# EAGLE board telakone (EAGLE 7.6.0)
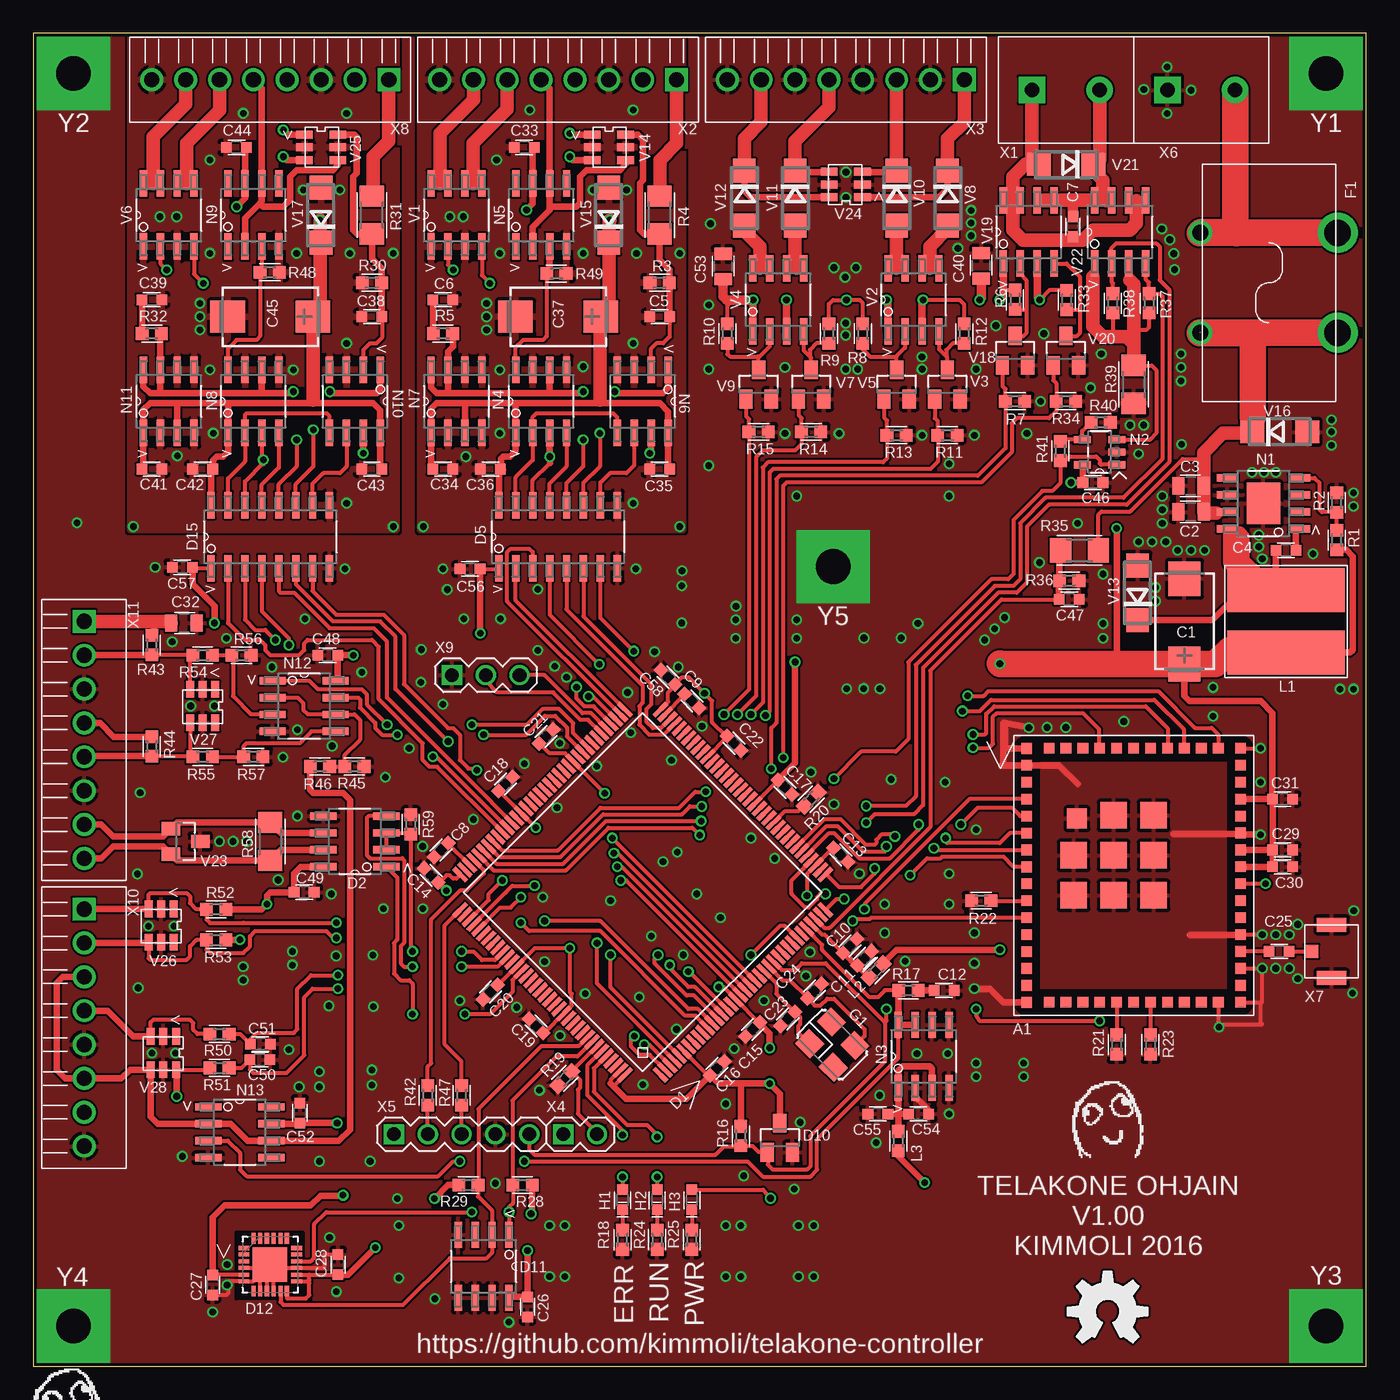
[diagram p8: board, top side]
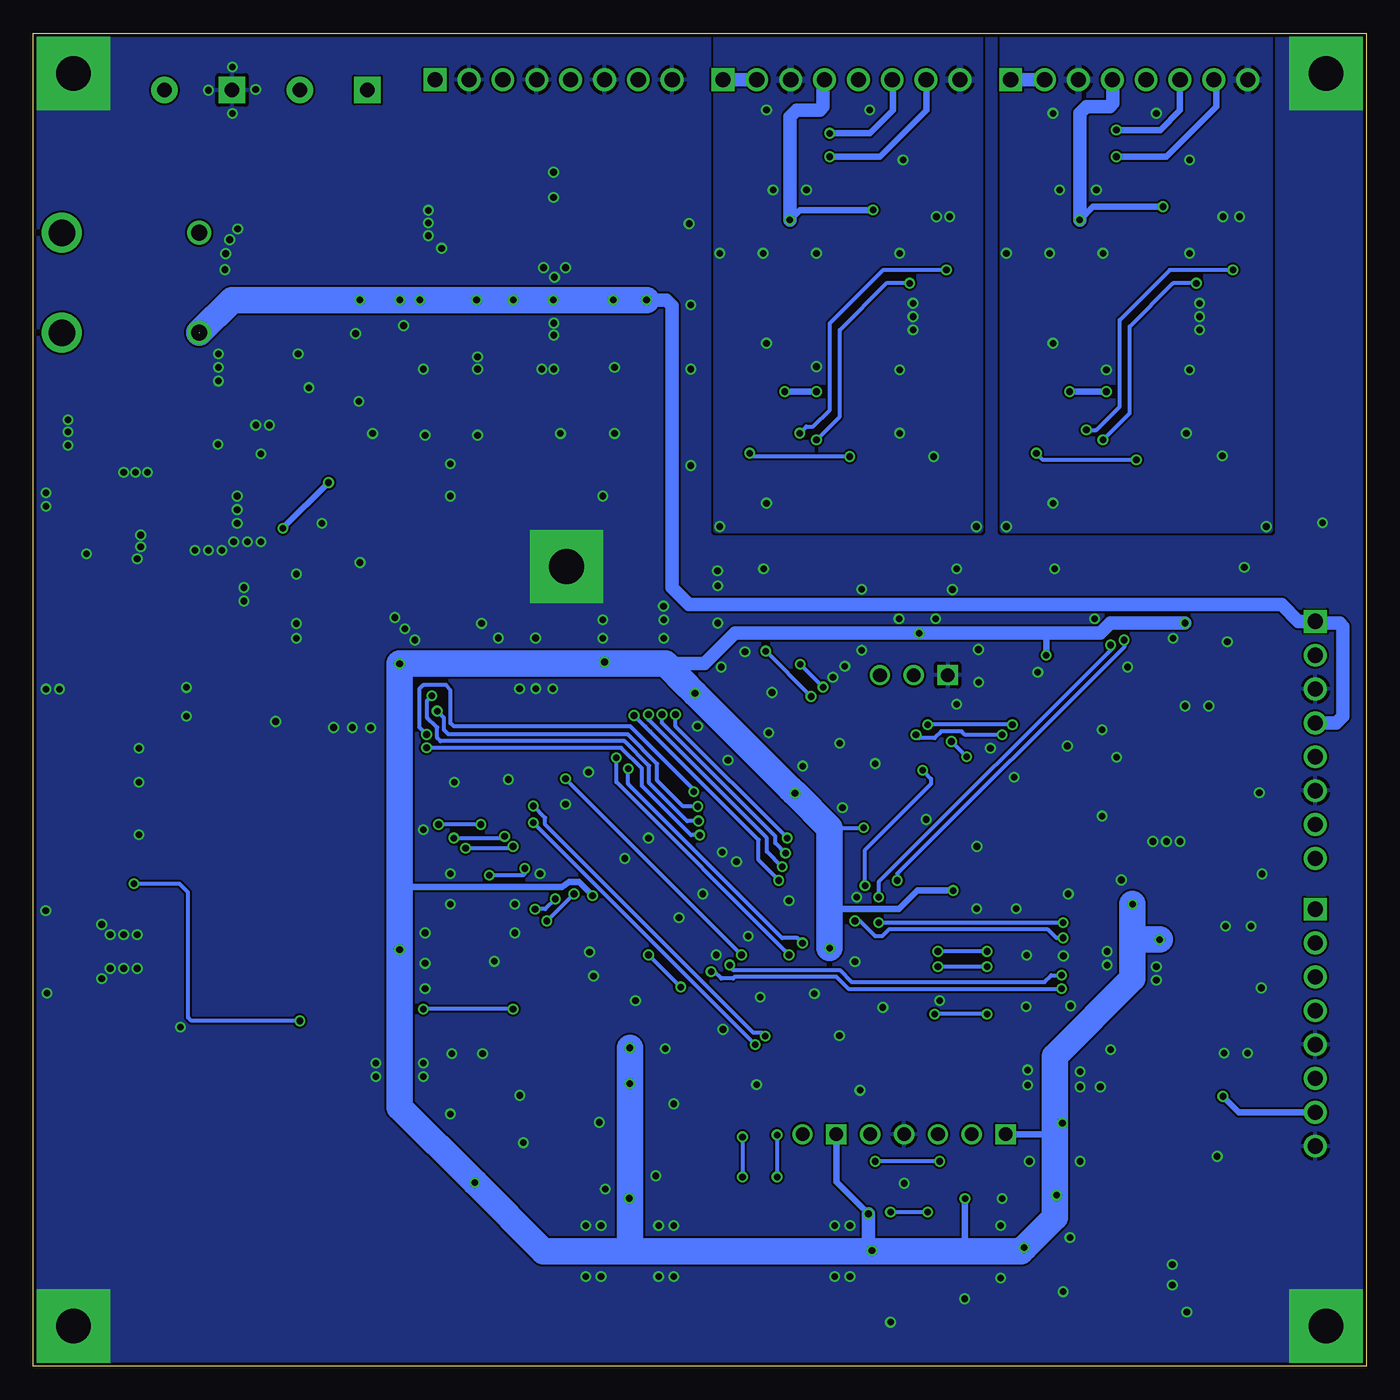
[diagram p9: board, bottom side, seen from below]

Size 100 x 100 mm. Coordinates in mm from the lower left corner, seen from the top.
Outline: 0,0 100,0 100,100 0,100 0,0
Copper layers (1*16): Top 0.035mm / dielectric 1.5mm / Bottom 0.035mm
Design rules "ITEADstudio_DRC": minimum track width 6mil, minimum drill 12mil, track to track 6mil, track to pad 6mil, pad to pad 6mil, via to via 6mil, smd to smd 0mil, copper to edge 10mil, drill to drill 10mil, minimum pad ring 10mil, minimum via ring 6mil, stop-mask expansion 2mil, vias tented up to drill 100mil, thermal gap 10mil
Net classes: 1 isolation: width 0.3 mm, drill 0.5 mm; 2 other: width 0.3 mm, drill 0.3 mm, clearance 1 mm to class 1
tRestrict: area 15.2,5.1 to 20.2,10; area 57.3,21.5 to 62.6,26.8; 4 lines

## Footprints (pad centres in the part's own frame; a part is rotated, then mirrored left to right if it is on the bottom)
CC3100MOD = smd 0.8 x 0.8: P1 9.52,8.025; P2 8.25,8.025; P3 6.98,8.025; P4 5.71,8.025; P5 4.44,8.025; P6 3.17,8.025; P7 1.9,8.025; P8 0.63,8.025; P9 -0.64,8.025; P10 -1.91,8.025; P11 -3.18,8.025; P12 -4.45,8.025; P13 -5.72,8.025; P14 -6.99,8.025; P15 -8.26,8.025; P16 -9.53,8.025; P17 -9.525,6.35; P18 -9.525,5.08; P19 -9.525,3.81; P20 -9.525,2.54; P21 -9.525,1.27; P22 -9.525,0; P23 -9.525,-1.27; P24 -9.525,-2.54; P25 -9.525,-3.81; P26 -9.525,-5.08; P27 -9.525,-6.35; P28 -9.525,-8.02; P29 -8.255,-8.02; P30 -6.985,-8.02; P31 -5.715,-8.02; P32 -4.445,-8.02; P33 -3.175,-8.02; P34 -1.905,-8.02; P35 -0.635,-8.02; P36 0.635,-8.02; P37 1.905,-8.02; P38 3.175,-8.02; P39 4.445,-8.02; P40 5.715,-8.02; P41 6.985,-8.02; P42 8.255,-8.02; P43 9.525,-8.02; P44 9.525,-6.35; P45 9.525,-5.08; P46 9.525,-3.81; P47 9.525,-2.54; P48 9.525,-1.27; P49 9.525,0; P50 9.525,1.27; P51 9.525,2.54; P52 9.525,3.81; P53 9.525,5.08; P54 9.525,6.35 | smd 1.5 x 1.5: P55 4.25,4.25 | smd 2 x 2: P56 1.5,-1.5; P57 -1.5,4.5; P58 4.5,1.5; P59 1.5,1.5; P60 -1.5,1.5; P61 4.5,-1.5; P62 1.5,4.5; P63 -1.5,-1.5
CT7343 = smd 2.6 x 2.4: + 3.2,0; - -3.2,0
C0805 = smd 0.9 x 1.3: 1 -0.95,0; 2 0.95,0
C0603 = smd 0.8 x 0.8: 1 -0.75,0; 2 0.75,0
LQFP-144 = smd 0.34 x 1.35: 1 -8.75,-10.625; 2 -8.25,-10.625; 3 -7.75,-10.625; 4 -7.25,-10.625; 5 -6.75,-10.625; 6 -6.25,-10.625; 7 -5.75,-10.625; 8 -5.25,-10.625; 9 -4.75,-10.625; 10 -4.25,-10.625; 11 -3.75,-10.625; 12 -3.25,-10.625; 13 -2.75,-10.625; 14 -2.25,-10.625; 15 -1.75,-10.625; 16 -1.25,-10.625; 17 -0.75,-10.625; 18 -0.25,-10.625; 19 0.25,-10.625; 20 0.75,-10.625; 21 1.25,-10.625; 22 1.75,-10.625; 23 2.25,-10.625; 24 2.75,-10.625; 25 3.25,-10.625; 26 3.75,-10.625; 27 4.25,-10.625; 28 4.75,-10.625; 29 5.25,-10.625; 30 5.75,-10.625; 31 6.25,-10.625; 32 6.75,-10.625; 33 7.25,-10.625; 34 7.75,-10.625; 35 8.25,-10.625; 36 8.75,-10.625; 73 8.75,10.625; 74 8.25,10.625; 75 7.75,10.625; 76 7.25,10.625; 77 6.75,10.625; 78 6.25,10.625; 79 5.75,10.625; 80 5.25,10.625; 81 4.75,10.625; 82 4.25,10.625; 83 3.75,10.625; 84 3.25,10.625; 85 2.75,10.625; 86 2.25,10.625; 87 1.75,10.625; 88 1.25,10.625; 89 0.75,10.625; 90 0.25,10.625; 91 -0.25,10.625; 92 -0.75,10.625; 93 -1.25,10.625; 94 -1.75,10.625; 95 -2.25,10.625; 96 -2.75,10.625; 97 -3.25,10.625; 98 -3.75,10.625; 99 -4.25,10.625; 100 -4.75,10.625; 101 -5.25,10.625; 102 -5.75,10.625; 103 -6.25,10.625; 104 -6.75,10.625; 105 -7.25,10.625; 106 -7.75,10.625; 107 -8.25,10.625; 108 -8.75,10.625 | smd 1.35 x 0.34: 37 10.625,-8.75; 38 10.625,-8.25; 39 10.625,-7.75; 40 10.625,-7.25; 41 10.625,-6.75; 42 10.625,-6.25; 43 10.625,-5.75; 44 10.625,-5.25; 45 10.625,-4.75; 46 10.625,-4.25; 47 10.625,-3.75; 48 10.625,-3.25; 49 10.625,-2.75; 50 10.625,-2.25; 51 10.625,-1.75; 52 10.625,-1.25; 53 10.625,-0.75; 54 10.625,-0.25; 55 10.625,0.25; 56 10.625,0.75; 57 10.625,1.25; 58 10.625,1.75; 59 10.625,2.25; 60 10.625,2.75; 61 10.625,3.25; 62 10.625,3.75; 63 10.625,4.25; 64 10.625,4.75; 65 10.625,5.25; 66 10.625,5.75; 67 10.625,6.25; 68 10.625,6.75; 69 10.625,7.25; 70 10.625,7.75; 71 10.625,8.25; 72 10.625,8.75; 109 -10.625,8.75; 110 -10.625,8.25; 111 -10.625,7.75; 112 -10.625,7.25; 113 -10.625,6.75; 114 -10.625,6.25; 115 -10.625,5.75; 116 -10.625,5.25; 117 -10.625,4.75; 118 -10.625,4.25; 119 -10.625,3.75; 120 -10.625,3.25; 121 -10.625,2.75; 122 -10.625,2.25; 123 -10.625,1.75; 124 -10.625,1.25; 125 -10.625,0.75; 126 -10.625,0.25; 127 -10.625,-0.25; 128 -10.625,-0.75; 129 -10.625,-1.25; 130 -10.625,-1.75; 131 -10.625,-2.25; 132 -10.625,-2.75; 133 -10.625,-3.25; 134 -10.625,-3.75; 135 -10.625,-4.25; 136 -10.625,-4.75; 137 -10.625,-5.25; 138 -10.625,-5.75; 139 -10.625,-6.25; 140 -10.625,-6.75; 141 -10.625,-7.25; 142 -10.625,-7.75; 143 -10.625,-8.25; 144 -10.625,-8.75
SOIC8-N_MC = smd 1.981 x 0.559: 1 -2.362,1.905; 2 -2.362,0.635; 3 -2.362,-0.635; 4 -2.362,-1.905; 5 2.362,-1.905; 6 2.362,-0.635; 7 2.362,0.635; 8 2.362,1.905
SOIC16-N = smd 1.981 x 0.559: 1 -2.362,1.905; 2 -2.362,0.635; 3 -2.362,-0.635; 4 -2.362,-1.905; 5 -2.362,-3.175; 6 -2.362,-4.445; 7 -2.362,-5.715; 8 -2.362,-6.985; 9 2.362,-6.985; 10 2.362,-5.715; 11 2.362,-4.445; 12 2.362,-3.175; 13 2.362,-1.905; 14 2.362,-0.635; 15 2.362,0.635; 16 2.362,1.905
SOT23 = smd 1 x 1.4: 1 -0.95,-1.1; 2 0.95,-1.1; 3 0,1.1
QFN50P400X400X100-25N = smd 0.813 x 0.305: 1 -1.981,1.245; 2 -1.981,0.762; 3 -1.981,0.254; 4 -1.981,-0.254; 5 -1.981,-0.762; 6 -1.981,-1.245; 13 1.981,-1.245; 14 1.981,-0.762; 15 1.981,-0.254; 16 1.981,0.254; 17 1.981,0.762; 18 1.981,1.245 | smd 0.305 x 0.813: 7 -1.245,-1.981; 8 -0.762,-1.981; 9 -0.254,-1.981; 10 0.254,-1.981; 11 0.762,-1.981; 12 1.245,-1.981; 19 1.245,1.981; 20 0.762,1.981; 21 0.254,1.981; 22 -0.254,1.981; 23 -0.762,1.981; 24 -1.245,1.981 | smd 2.591 x 2.591: 25 -0.025,0
KEYSTONE-3549-2 = drill 1.2: 1 -3.75,5.15; 2 3.75,5.15 | drill 2: 3 3.75,-5.15; 4 -3.75,-5.15
X_3225 = smd 1.6 x 1.5: 1 -1.25,-1.15; 2 1.25,-1.15; 3 1.25,1.15; 4 -1.25,1.15
CHIP-LED0603 = smd 0.8 x 0.8: A -0.75,0; C 0.75,0
VLP8040 = smd 3.3 x 8.8: 1 -2.35,0; 2 2.35,0
R0603 = smd 0.95 x 0.95: 1 -0.725,0; 2 0.725,0
SOIC8-N-EP = smd 1.6 x 0.559: 1 -2.7,1.905; 2 -2.7,0.635; 3 -2.7,-0.635; 4 -2.7,-1.905; 5 2.7,-1.905; 6 2.7,-0.635; 7 2.7,0.635; 8 2.7,1.905 | smd 2.5 x 3.1: EP 0,0
SOT95P280X145-5N = smd 1.27 x 0.559: 1 -1.295,0.94; 2 -1.295,0; 3 -1.295,-0.94; 4 1.295,-0.94; 5 1.295,0.94
R1206 = smd 1.6 x 1.803: 1 -1.422,0; 2 1.422,0
DO214AC = smd 1.8 x 1.7: A 2.05,0; C -2.05,0
SOT23-6 = smd 1.25 x 0.6: 1 -1.25,0.95; 2 -1.25,0; 3 -1.25,-0.95; 4 1.25,-0.95; 5 1.25,0; 6 1.25,0.95
TE_RUUVILIITIN2 = drill 1.1 pad 2 square: 1 0,0 | drill 1.1 pad 2: 2 5.08,0
MPT0.5/8-2.54 = drill 1.143 square: 1 0,0 | drill 1.143: 2 2.54,0; 3 5.08,0; 4 7.62,0; 5 10.16,0; 6 12.7,0; 7 15.24,0; 8 17.78,0
PIIKKIRIMA-2 = drill 1.016 square: 1 0,0 | drill 1.016: 2 2.54,0
PIIKKIRIMA-5 = drill 1.016 square: 1 0,0 | drill 1.016: 2 2.54,0; 3 5.08,0; 4 7.62,0; 5 10.16,0
U.FL-R-SMT-1 = smd 1.05 x 2.2: GND1 -2,0; GND2 2,0 | smd 1 x 1.05: SIG 0,-1.525
PIIKKIRIMA-3 = drill 1.016 square: 1 0,0 | drill 1.016: 2 2.54,0; 3 5.08,0
PTH-2.6-5.5SQ = drill 2.6 pad 5.5 square: 1 0,0

## Placement (x,y rotation side)
A1  CC3100MOD  [CC3100MOD]  82.55,36.83 90 top
C1  220u 16V D  [CT7343]  86.36,55.88 270 top
C2  2u2 50V 0805  [C0805]  86.85,64.1 180 top
C3  2u2 50V 0805  [C0805]  86.85,66.06 180 top
C4  10n  [C0603]  93.98,61.21 0 top
C5  10n  [C0603]  46.99,78.74 180 top
C6  2u2  [C0603]  30.73,80.01 0 top
C7  10n  [C0603]  78,85.5 90 top
C8  2u2  [C0603]  30.61,38.73 225 top
C9  2u2  [C0603]  49.4,49.91 315 top
C10  100n  [C0603]  61.27,31.53 45 top
C11  2u2  [C0603]  62.36,30.61 45 top
C12  2u2  [C0603]  68.33,28.19 0 top
C13  100n  [C0603]  60.58,38.35 315 top
C14  100n  [C0603]  29.84,36.83 135 top
C15  100n  [C0603]  53.98,25.27 225 top
C16  100n  [C0603]  51.31,22.35 45 top
C17  100n  [C0603]  56.39,43.43 315 top
C18  100n  [C0603]  35.43,43.69 45 top
C19  100n  [C0603]  37.72,25.53 135 top
C20  100n  [C0603]  34.29,28.07 225 top
C21  100n  [C0603]  38.48,47.24 45 top
C22  100n  [C0603]  52.58,46.74 315 top
C23  22p  [C0603]  56.6,26.07 225 top
C24  22p  [C0603]  58.6,28.14 45 top
C25  10p  [C0603]  93.47,31.11 0 top
C26  100n  [C0603]  37.08,4.45 270 top
C27  100n  [C0603]  13.46,6.1 270 top
C28  2u2  [C0603]  22.86,7.62 90 top
C29  2u2  [C0603]  93.73,38.73 0 top
C30  2u2  [C0603]  93.73,37.47 0 top
C31  100n  [C0603]  93.73,42.55 0 top
C32  2u2 50V 0805  [C0805]  11.3,55.75 0 top
C33  100n  [C0603]  36.83,91.44 180 top
C34  100n  [C0603]  30.73,67.31 0 top
C35  100n  [C0603]  46.99,67.31 180 top
C36  100n  [C0603]  34.29,67.31 180 top
C37  220u 16V D  [CT7343]  39.37,78.74 0 top
C38  10n  [C0603]  25.4,78.74 180 top
C39  2u2  [C0603]  8.89,80.01 0 top
C40  2u2 50V 0805  [C0805]  71.12,82.55 90 top
C41  100n  [C0603]  8.89,67.31 0 top
C42  100n  [C0603]  12.7,67.31 180 top
C43  100n  [C0603]  25.4,67.31 180 top
C44  100n  [C0603]  15.24,91.44 180 top
C45  220u 16V D  [CT7343]  17.78,78.74 0 top
C46  100n  [C0603]  79.49,66.29 0 top
C47  10n  [C0603]  77.72,57.53 0 top
C48  100n  [C0603]  22.09,53.34 180 top
C49  100n  [C0603]  20.32,35.56 0 top
C50  10n  [C0603]  17,23 0 top
C51  10n  [C0603]  17.03,24.17 0 top
C52  100n  [C0603]  20,19 90 top
C53  2u2 50V 0805  [C0805]  51.75,82.5 90 top
C54  2u2  [C0603]  66.42,18.92 0 top
C55  100n  [C0603]  63.37,18.92 180 top
C56  100n  [C0603]  32.77,59.82 180 top
C57  100n  [C0603]  11.18,59.94 180 top
C58  100n  [C0603]  47.62,51.69 135 top
D1  STM32F407ZG  [LQFP-144]  45.72,35.56 45 top
D2  MAX3430_SA  [SOIC8-N_MC]  24.13,39.37 180 top
D5  SI8661-IS1  [SOIC16-N]  36.83,62.23 90 top
D10  RT9818C-29GV  [SOT23]  56.01,17.14 0 top
D11  LM75BD  [SOIC8-N_MC]  33.78,7.49 270 top
D12  IIS328DQTR  [QFN50P400X400X100-25N]  17.78,7.62 0 top
D15  SI8661-IS1  [SOIC16-N]  15.24,62.23 90 top
F1  KEYSTONE-3549-2  [KEYSTONE-3549-2]  92.71,81.28 90 top
G1  25MHz  [X_3225]  59.94,24.13 315 top
H1  RED  [CHIP-LED0603]  44.2,12.5 270 top
H2  GRN  [CHIP-LED0603]  46.8,12.5 270 top
H3  GRN  [CHIP-LED0603]  49.4,12.5 270 top
L1  VLP8040-47U  [VLP8040]  93.98,55.88 270 top
L2  IND0603  [R0603]  63.23,29.68 45 top
L3  IND0603  [R0603]  64.9,16.89 270 top
N1  TPS5430DDA  [SOIC8-N-EP]  92.29,64.73 180 top
N2  LTC2050CS5  [SOT95P280X145-5N]  79.99,68.58 180 top
N3  MCP1501/SN  [SOIC8-N_MC]  66.8,23.24 90 top
N4  MCP4921/SN  [SOIC8-N_MC]  38.1,72.39 90 top
N5  TS921IDT  [SOIC8-N_MC]  38.1,86.36 90 top
N6  MCP3201/SN  [SOIC8-N_MC]  45.72,72.39 270 top
N7  MCP1501/SN  [SOIC8-N_MC]  31.75,72.39 90 top
N8  MCP4921/SN  [SOIC8-N_MC]  16.51,72.39 90 top
N9  TS921IDT  [SOIC8-N_MC]  16.51,86.36 90 top
N10  MCP3201/SN  [SOIC8-N_MC]  24.13,72.39 270 top
N11  MCP1501/SN  [SOIC8-N_MC]  10.16,72.39 90 top
N12  AZV3002S  [SOIC8-N_MC]  20.32,49.53 0 top
N13  TS921IDT  [SOIC8-N_MC]  15.49,17.55 0 top
R1  10k0  [R0603]  97.79,61.98 90 top
R2  5k90  [R0603]  97.79,64.79 90 top
R3  825  [R0603]  46.99,81.28 0 top
R4  19k1 1206  [R1206]  46.99,86.36 270 top
R5  1k00  [R0603]  30.73,77.47 0 top
R6  2k00  [R0603]  73.66,80.01 90 top
R7  2k00  [R0603]  73.66,72.39 0 top
R8  2k00  [R0603]  62.23,77.47 90 top
R9  2k00  [R0603]  59.69,77.47 90 top
R10  2k00  [R0603]  52.07,77.47 90 top
R11  2k00  [R0603]  68.58,69.85 0 top
R12  2k00  [R0603]  69.85,77.47 90 top
R13  2k00  [R0603]  64.77,69.85 0 top
R14  2k00  [R0603]  58.36,70.1 0 top
R15  2k00  [R0603]  54.42,70.1 0 top
R16  2k00  [R0603]  53.09,17.27 90 top
R17  1k00  [R0603]  65.66,28.19 180 top
R18  499  [R0603]  44.2,9.5 90 top
R19  2k00  [R0603]  39.88,21.59 45 top
R20  2k00  [R0603]  58.37,42.55 225 top
R21  2k00  [R0603]  81.28,24.13 90 top
R22  2k00  [R0603]  71.12,34.92 0 top
R23  2k00  [R0603]  83.82,24.13 90 top
R24  499  [R0603]  46.8,9.5 90 top
R25  499  [R0603]  49.4,9.5 90 top
R28  2k00  [R0603]  36.7,13.59 0 top
R29  2k00  [R0603]  32.64,13.59 180 top
R30  825  [R0603]  25.4,81.28 0 top
R31  19k1 1206  [R1206]  25.4,86.36 270 top
R32  1k00  [R0603]  8.89,77.47 0 top
R33  2k00  [R0603]  77.53,79.99 90 top
R34  2k00  [R0603]  77.47,72.39 0 top
R35  5k90 1206  [R1206]  78.49,61.21 180 top
R36  825  [R0603]  77.72,58.93 180 top
R37  2k00  [R0603]  83.7,79.74 270 top
R38  2k00  [R0603]  80.99,79.74 270 top
R39  ERJ-8BWFR010V  [R1206]  82.55,73.66 90 top
R40  10  [R0603]  80.08,70.82 0 top
R41  499  [R0603]  77.05,68.67 90 top
R42  499  [R0603]  29.59,20.32 90 top
R43  1k00  [R0603]  8.89,54.11 90 top
R44  1k00  [R0603]  8.89,46.49 90 top
R45  499  [R0603]  24.09,45 180 top
R46  2k00  [R0603]  21.5,45 180 top
R47  499  [R0603]  32.13,20.32 90 top
R48  100k  [R0603]  17.74,82.07 180 top
R49  100k  [R0603]  39.24,81.98 180 top
R50  499  [R0603]  13.97,24.92 180 top
R51  499  [R0603]  13.97,22.38 180 top
R52  2k00  [R0603]  13.72,34.27 0 top
R53  2k00  [R0603]  13.72,31.98 0 top
R54  30k1  [R0603]  12.7,53.34 180 top
R55  30k1  [R0603]  12.7,45.72 180 top
R56  5k90  [R0603]  15.62,53.34 180 top
R57  5k90  [R0603]  16.51,45.72 180 top
R58  121 1206  [R1206]  17.78,39.37 90 top
R59  2k00  [R0603]  28.32,40.64 270 top
U$1  DAFUG  [DAFUG]  80.8,18.25 0 top
U$3  DAFUG  [DAFUG]  2.75,-3.3 0 top  (outside the outline)
U$5  DAFUG  [DAFUG]  2.75,-9.05 0 top  (outside the outline)
U$7  DAFUG  [DAFUG]  2.75,-14.8 0 top  (outside the outline)
U$9  DAFUG  [DAFUG]  2.75,-20.55 0 top  (outside the outline)
U$11  DAFUG  [DAFUG]  2.75,-26.3 0 top  (outside the outline)
U$13  DAFUG  [DAFUG]  2.75,-32.05 0 top  (outside the outline)
U$15  DAFUG  [DAFUG]  2.75,-37.8 0 top  (outside the outline)
V1  AO4886  [SOIC8-N_MC]  31.75,86.36 90 top
V2  AO4803A  [SOIC8-N_MC]  66.04,80.01 90 top
V3  2N7002K  [SOT23]  68.58,73.66 0 top
V4  AO4803A  [SOIC8-N_MC]  55.88,80.01 90 top
V5  2N7002K  [SOT23]  64.77,73.66 0 top
V6  AO4886  [SOIC8-N_MC]  10.16,86.36 90 top
V7  2N7002K  [SOT23]  58.36,73.66 0 top
V8  SK34A  [DO214AC]  68.58,87.63 270 top
V9  2N7002K  [SOT23]  54.42,73.66 0 top
V10  SK34A  [DO214AC]  64.77,87.63 270 top
V11  SK34A  [DO214AC]  57.15,87.63 270 top
V12  SK34A  [DO214AC]  53.34,87.63 270 top
V13  SK34A  [DO214AC]  82.86,58.02 90 top
V14  WURTH 82402304  [SOT23-6]  43.18,91.44 0 top
V15  SMAJ5.0A  [DO214AC]  43.18,86.36 90 top
V16  SMAJ20A  [DO214AC]  93.52,70.1 0 top
V17  SMAJ5.0A  [DO214AC]  21.59,86.36 90 top
V18  2N7002K  [SOT23]  73.66,76.2 0 top
V19  AO4803A  [SOIC8-N_MC]  74.68,85.09 90 top
V20  2N7002K  [SOT23]  77.47,76.2 0 top
V21  SMAJ20CA  [DO214AC]  77.49,90.17 180 top
V22  AO4886  [SOIC8-N_MC]  81.53,85.09 90 top
V23  SM712  [SOT23]  11.43,39.37 270 top
V24  ESDA19SC6  [SOT23-6]  60.96,88.65 180 top
V25  WURTH 82402304  [SOT23-6]  21.59,91.44 0 top
V26  WURTH 82402304  [SOT23-6]  9.59,33.06 270 top
V27  ESDA19SC6  [SOT23-6]  12.7,49.53 270 top
V28  WURTH 82402304  [SOT23-6]  9.75,23.5 270 top
X1  [TE_RUUVILIITIN2]  74.93,95.75 0 top
X2  MPT0.5/8-2.54  [MPT0.5/8-2.54]  48.26,96.52 180 top
X3  MPT0.5/8-2.54  [MPT0.5/8-2.54]  69.85,96.52 180 top
X4  PIIKKIRIMA-2  [PIIKKIRIMA-2]  39.75,17.4 0 top
X5  PIIKKIRIMA-5  [PIIKKIRIMA-5]  27.05,17.4 0 top
X6  [TE_RUUVILIITIN2]  85.09,95.75 0 top
X7  U.FL-R-SMT-1  [U.FL-R-SMT-1]  97.41,31.11 270 top
X8  MPT0.5/8-2.54  [MPT0.5/8-2.54]  26.67,96.52 180 top
X9  PIIKKIRIMA-3  [PIIKKIRIMA-3]  31.4,51.85 0 top
X10  MPT0.5/8-2.54  [MPT0.5/8-2.54]  3.81,34.29 270 top
X11  MPT0.5/8-2.54  [MPT0.5/8-2.54]  3.81,55.88 270 top
Y1  PTH2.6-5.5SQ  [PTH-2.6-5.5SQ]  96.99,96.99 0 top
Y2  PTH2.6-5.5SQ  [PTH-2.6-5.5SQ]  3.01,96.99 0 top
Y3  PTH2.6-5.5SQ  [PTH-2.6-5.5SQ]  96.99,3.01 0 top
Y4  PTH2.6-5.5SQ  [PTH-2.6-5.5SQ]  3.01,3.01 0 top
Y5  PTH2.6-5.5SQ  [PTH-2.6-5.5SQ]  60,60 0 top

## Tracks (layer width: path | path; a pad name or v marks a point on that pad's centre or on a via)
+3V3  (via drill 0.5)
  Top 0.3: D1.62 52.05,47.19 | 52.05,47.19 C22.1 | C19.1 38.34,25 D1.131 40.39,27.04 40.39,27.94 40.26,28.07 v40.26,31.37 37.64,31.37 D1.121 34.87,28.6 C20.1 | C18.1 34.82,43.16 34.8,43.18 34.92,43.18 D1.95 v37.7,40.4 | C15.1 54.42,25.8 D1.17 51.77,28.45 v51.44,28.45 | D1.6 50.62,21.82 50.67,21.82 C16.1 | D1.52 55.86,43.93 C17.1 | D1.108 32.02,36.85 31.75,36.58 31.5,36.58 31.24,36.83 30.99,36.83 30.42,36.26 | D12.14 20.7,6.86 | 20.7,6.86 22.85,6.86 C28.1 | C27.1 13.47,6.86 D12.5 C27.1 | D12.12 19.02,5.11 19.05,5.08 20.45,5.08 20.7,5.33 20.7,6.22 20.55,6.38 D12.13 20.6,6.38 20.7,6.48 20.7,6.86 | C56.1 34.92,59.82 | C57.1 12,59.87 D15.1 | C21.1 37.99,46.71 38.73,45.97 39.9,45.97 D1.84 42.86,43.01 v42.86,42.99 | C13.1 60,38.88 D1.39 58.04,36.92 v58.04,35.31 | 15.47,31.98 v15.49,32 | D1.72 47.62,49.84 47.62,50.55 48.16,51.08 C58.1 48.69,51.69 49.15,51.69 v50.35,50.48 50.93,49.91 50.93,48.31 52.05,47.19 | D1.30 56.39,33.02 56.01,33.02 v53.85,30.86 | D1.143 43.31,21.48 43.31,21.21 | D1.144 43.55,21.02 43.5,21.02 | 30.42,36.26 | 37.71,40.39 v37.7,40.4 | v37.7,40.4 | H3.A 54.75,13.25 v55.3,12.6
  Top 0.5: N2.5 78.74,67.59 C46.1 v77.85,66.29 | L1.2 98.78,53.53 99,53.75 99,60.75 98.5,61.26 R1.1 | N13.7 19.93,18.18 C52.1 21.55,18.25 v22.79,18.24 | N12.8 22.84,51.59 C48.1 v24,53.34 | C29.1 A1.P37 | A1.P36 C30.1 C29.1 | 92.96,42.55 A1.P40 90.55,42.55 | C29.1 C31.1 92.96,42.55 | C1.+ 86.36,50.29 86.74,49.91 92.08,49.91 92.96,49.02 92.96,42.55 | 93.09,42.42 92.96,42.55 | C28.1 23.63,6.87 v25.66,8.89 | C27.1 13.46,11.18 14.35,12.06 20.82,12.06 21.55,12.8 23.2,12.8 23.25,12.85 | 23.25,12.8 23.25,12.85 | 23.25,12.85 v23.24,12.83 | v37.08,8.68 C26.1 35.75,5.2 D11.8 | R28.2 37.43,11.52 v37.34,11.43 | R29.2 31.11,13.59 v30.1,12.57 | D2.8 20.07,37.47 19.57,36.97 C49.1 17.78,35.56 17.53,35.31 v17.53,34.67 17.12,34.27 R52.2 | R53.2 15.47,31.98 | C56.1 33.52,55 v33.53,54.99 | v13.59,55.75 13.59,57.02 11.94,58.67 C57.1 | L3.2 64.9,15.75 v66.86,13.78 | 54.42,25.8 55.24,24.97 v55.24,23.88 | C16.1 51.39,21.21 53.09,21.21 | 53.09,21.21 v55.24,21.21 56.01,20.45 D10.3 | R16.2 53.09,21.21 | L2.2 63.74,30.21 64.77,31.24 v72.52,31.24 | C17.1 57.15,45.26 v57.15,52.83 | 57.91,35.31 v58.04,35.31 | 43.31,21.21 43.5,21.02 44.45,20.07 49.02,20.07 50.67,21.72 50.67,21.82 | v81.28,62.87 81.28,53.21 81.15,53.09 81.15,52.68 | 34.92,59.82 D5.1 | C14.1 30.42,36.26 v30.99,35.69 | v30.99,35.69
  Top 2: L1.2 93.95,53.5 93.75,53.5 93.5,53.75 89.75,53.75 88.68,52.68 C1.+ 81.15,52.68 72.54,52.68 v72.52,52.7
  Bottom 0.3: 42.93,43.18 42.93,43.05 | v42.86,42.99 43.18,43.31 | v50.35,50.48 50.55,50.67 50.55,50.8 50.74,50.99 50.86,50.99 | v53.85,30.86 v51.44,28.45 | 37.34,8.51 37.21,8.64 37.08,8.64 | v37.7,40.4 37.75,40.35 40.25,40.35 40.26,40.34 40.26,40.25 | v55.3,12.6 55.3,12.7 55.25,12.65 55.25,12.3 55.24,12.3
  Bottom 0.5: v22.79,18.24 23.37,18.29 | v25.66,8.89 v25.65,8.89 | v23.24,12.83 23.37,12.7 | v37.08,8.68 37.08,8.64 | X4.1 39.75,13.84 v37.34,11.43 | X5.1 23.37,17.4 | v30.1,12.57 30.1,8.76 30.23,8.64 | v24,53.34 24,54.99 | v55.24,21.21 55.12,21.08 55.12,20.7 55.24,20.57 55.24,20.45 | 58.29,52.83 58.29,52.7 58.42,52.58 57.4,52.58 v57.15,52.83 52.7,52.83 52.58,52.7 | v58.04,35.31 59.05,36.32 59.82,36.32 60.33,35.94 72.52,35.94 | v77.85,66.29 v81.28,62.87 | v30.99,35.69 33.66,35.69 35.05,34.29 40.26,34.29
  Bottom 1: 52.58,52.7 49.66,52.7 47.37,54.99 v33.53,54.99 24,54.99 19.94,54.99 19.18,55.75 v13.59,55.75 | v37.34,11.43 37.34,8.51
  Bottom 2: 55.24,8.64 61.72,8.64 v66.86,13.78 72.52,19.43 v72.52,31.24 72.52,35.94 v72.52,52.7 52.58,52.7 50.86,50.99 v50.35,50.48 43.18,43.31 42.93,43.05 v42.86,42.99 40.26,40.39 40.26,40.25 40.26,34.29 v40.26,31.37 | 55.24,8.64 37.08,8.64 30.23,8.64 25.91,8.64 v25.65,8.89 23.37,11.18 23.37,12.7 23.37,17.4 23.37,18.29 23.37,23.24 17.53,29.08 17.53,32 | 17.53,32 v17.53,34.67 | v15.49,32 17.53,32 | v55.24,23.88 v55.24,21.21 55.24,20.45 55.24,12.3 55.24,8.64
+12V  (via drill 0.5)  (1 unrouted)
  Top 0.3: R10.2 52.07,79.57 52.5,80 v54,80 | R9.2 59.69,79.69 60,80 v61,80 62,80 62.23,79.77 R8.2 | R12.2 69.85,79.65 69.5,80 v66.75,80 | R6.2 72.79,80.73 72.78,80.75 | R33.2 76.22,80.72 v75.5,80 | R35.1 79.91,63.91 80.14,64.14 82.3,64.14 86.23,68.07 87.8,68.07 | 3.75,48.25 3.76,48.26 X11.4
  Top 0.5: 88.75,64 89.5,64 N1.7 | R44.2 6.04,47.22 5,48.25 3.75,48.25 | R43.2 9.02,54.96 9.02,55.88 | 87.88,63.88 88.01,64.01 87.99,64.01 87.94,64.06
  Top 0.55: v54,80 54,77.67 V4.1 | V4.3 56.52,79.98 v56.5,80 | V2.1 64.14,79.86 v64,80 | V2.3 66.67,79.92 v66.75,80 | V19.1 72.78,80.75 72.78,80.28 v72.5,80 | V19.3 75.31,80.19 v75.5,80
  Top 0.7: C40.1 71.12,80.12 v71,80 | C53.1 51.75,80.25 52,80 v54,80
  Top 1: 91.5,70.25 91.5,70.13 V16.C | 91.5,71.25 91.5,70.25 | 91.5,70.25 91.25,70 89.25,70 87.8,68.55 87.8,68.07 C3.1 C2.1 87.9,64.1 87.94,64.06 88,64 88.75,64 | C32.1 10.23,55.88 9.02,55.88 X11.1
  Top 2: F1.4 87.53,77.53 87.5,77.5 91.5,77.5 91.5,71.25
  Bottom 1: 54.61,80 52.5,80 52.07,79.57 52.07,58.42 50.8,57.15 6.35,57.15 5.08,55.88 X11.1 3.68,55.75 2,55.75 1.75,55.5 1.75,48.75 2.24,48.26 X11.4
  Bottom 2: v54,80 54.61,80 v56.5,80 v61,80 v64,80 v66.75,80 v71,80 v72.5,80 v75.5,80 85.09,80 F1.1
+48V_1
  Top 0.3: R4.1 47,87.75
  Top 1: X2.1 48.26,91.76 47,90.5 47,87.75 47,87.5
  Bottom 0.3: 48.25,96.5 X2.1
  Bottom 1: X2.2 48.23,96.52 48.25,96.5
+48V_2
  Top 1: X8.1 26.67,91.92 25.5,90.75 25.5,87.88 R31.1
  Bottom 1: X8.2 X8.1
ACCLINKRX  (via drill 0.5)
  Top 0.3: v32.38,26.42 34.29,26.42 35.94,28.07 35.94,28.96 D1.122 | D2.1 27.3,36.65 27.3,32 27.05,31.75 27.05,29.46 27.56,28.96 28.19,28.96 28.45,28.7 v28.45,26.42
  Bottom 0.3: v28.45,26.42 v32.38,26.42
ACCLINKTX  (via drill 0.5)
  Top 0.3: D2.4 25.15,41.27 25.02,41.15 25.02,38.35 25.27,38.1 27.69,38.1 27.81,37.97 27.81,31.75 27.56,31.5 27.56,30.23 27.81,29.97 v28.45,29.97 | D1.119 34.83,29.97 v32.13,29.97
  Bottom 0.3: v28.45,29.97 v32.13,29.97
ACCLINKTXE  (via drill 0.5)
  Top 0.3: D2.3 26.54,40.01 | 26.54,40.01 28.23,40.01 R59.2 28.32,31.24 v28.45,31.11 | D2.2 26.49,39.95 26.54,40.01 | v32.13,31.11 33.02,31.11 33.66,30.48 34.63,30.48 D1.118
  Bottom 0.3: v28.45,31.11 v32.13,31.11
ACCRTXHI
  Top 0.5: X11.7 5.11,40.64 6,39.75 9.76,39.75 V23.1 10.8,40.79 R58.2 18.57,40.01 D2.6
ACCRTXLO
  Top 0.5: X11.8 5.1,38.1 6,39 9.75,39 V23.2 10.8,37.95 R58.1 18.57,38.73 D2.7
AIN_1
  Top 0.3: N6.2 46.35,76.36 46.75,76.75 47.25,76.75 47.74,77.24 C5.1
  Top 0.5: V14.6 45.36,92.39 45.75,92 45.75,89 45.5,88.75 45.5,85.25 45.81,84.94 R4.2 46.99,83.01 47.72,82.28 R3.2 47.72,78.77 C5.1
AIN_2
  Top 0.3: C38.1 26.15,77.15 25.75,76.75 25.25,76.75 24.77,76.27 N10.2
  Top 0.5: V25.6 24.11,92.39 24.25,92.25 24.25,89.5 24,89.25 24,85.25 24.31,84.94 R31.2 25.4,83.1 26.12,82.38 R30.2 26.12,78.77 C38.1
BOOT0
  Top 0.3: D1.138 R19.2 41,21.48 41,20.9 40.85,20.75 40.85,18.95 42.29,17.51 X4.2
BRAKE_1  (via drill 0.5)
  Top 0.3: V1.4 33.66,81.84 v34.25,81.25 | v41.25,69.5 41.25,67.5 40.01,66.25 D5.12
  Bottom 0.3: v34.25,81.25 36,81.25 39.5,77.75 39.5,71.25 v41.25,69.5
BRAKE_2  (via drill 0.5)
  Top 0.3: V6.4 12.06,81.94 v12.75,81.25 | v19.75,69.5 19.75,67.5 18.41,66.17 D15.12
  Bottom 0.3: v12.75,81.25 14.5,81.25 17.75,78 17.75,71.5 v19.75,69.5
BRAKE_OD_1  (via drill 0.5)
  Top 0.5: V1.6 33,88.72 V1.5 | V14.1 40.36,92.39 v40.25,92.5
  Top 1: X2.6 35.56,94.31 33,91.75 33,88.72
  Bottom 0.5: v40.25,92.5 37.25,92.5 35.5,94.25 35.5,96.5 35.54,96.5 X2.6
BRAKE_OD_2  (via drill 0.5)
  Top 0.5: V6.6 11.5,88.72 V6.5 | V25.1 19.11,92.39 v18.75,92.75
  Top 1: X8.6 13.97,94.22 11.5,91.75 11.5,88.72
  Bottom 0.5: v18.75,92.75 15.44,92.75 13.97,94.22 X8.6
BUTTON1  (via drill 0.5)
  Top 0.3: V26.3 8.64,35.39 8.75,35.5 11.5,35.5 11.75,35.25 11.75,34.75 12.23,34.27 R52.1 12.99,33.51 13.25,33.25 15.75,33.25 15.77,33.27 v22.73,33.27 | v36.58,33.27 37.21,32.64 42.55,32.64 48.9,26.29 49.69,26.29 D1.11
  Top 0.5: X10.1 8.62,34.29 V26.3
  Bottom 0.3: v22.73,33.27 v36.58,33.27
BUTTON2  (via drill 0.5)
  Top 0.3: V26.4 8.64,30.61 8.75,30.5 11.5,30.5 11.75,30.75 11.75,31.5 12.23,31.98 R53.1 12.99,31.25 13.25,31 15.75,31 16.26,31.51 16.26,32.26 16.64,32.64 21.97,32.64 22.48,32.13 v22.73,32.13 | D1.12 49.89,26.8 49.15,26.8 42.55,33.4 v38.35,33.4
  Top 0.5: X10.2 8.58,31.75 V26.4
  Bottom 0.3: v22.73,32.13 23.24,32.13 23.88,32.77 35.81,32.77 36.32,32.26 36.83,32.26 37.97,33.4 v38.35,33.4
CCHIBL  (via drill 0.5)
  Top 0.3: A1.P4 70.23,42.54 62.36,34.67 v62.36,34.29 | D1.36 60.24,35.05 v60.83,35.05
  Bottom 0.3: v60.83,35.05 61.59,34.29 v62.36,34.29
CCIRQ  (via drill 0.5)
  Top 0.3: A1.P11 62.86,33.65 62.74,33.53 61.59,33.53 v61.47,33.4 | D1.40 57.78,37.37 57.78,37.34 56.9,36.45 56.9,35.43 57.91,34.42 58.17,34.42 58.8,35.05 58.8,35.18 59.05,35.43 v59.44,35.43
  Bottom 0.3: v61.47,33.4 v59.44,35.43
CCSPICLK  (via drill 0.5)
  Top 0.3: D1.41 59.71,40.01 60.07,40.01 61.98,38.1 64.26,38.1 66.42,40.26 v66.42,40.64 | v69.6,40.64 70.87,41.91 73.41,41.91 74.05,41.27 A1.P5
  Bottom 0.3: v66.42,40.64 v69.6,40.64
CCSPICSL  (via drill 0.5)
  Top 0.3: v65.79,36.83 67.06,38.1 68.07,38.1 68.2,38.23 72.77,38.23 73.54,37.46 A1.P8 | D1.37 59.51,36.89 60.45,35.94 62.1,35.94 63.12,36.96 v63.12,37.34
  Bottom 0.3: v63.12,37.34 63.12,36.96 63.25,36.83 v65.79,36.83
CCSPIMISO  (via drill 0.5)
  Top 0.3: D1.42 59.51,40.51 60.33,40.51 62.23,38.61 63.88,38.61 64.01,38.73 v64.01,38.99 | v67.56,38.86 67.7,38.73 A1.P7
  Bottom 0.3: v64.01,38.99 64.14,38.86 v67.56,38.86
CCSPIMOSI  (via drill 0.5)
  Top 0.3: A1.P6 73.28,40.01 72.52,39.24 68.58,39.24 68.45,39.37 v68.45,39.62 | v64.64,39.75 64.52,39.88 63.63,39.88 63.25,39.5 63.25,39.24 63.12,39.12 62.48,39.12 60.58,41.02 59.31,41.02 D1.43
  Bottom 0.3: v68.45,39.62 64.77,39.62 v64.64,39.75
D1BRAKE
  Top 0.3: D5.5 40.01,56.77 45.72,51.05 45.72,49.78 45.47,49.53 45.47,48.13 46.23,47.37 47.28,47.37 D1.69
D1REVERSE
  Top 0.3: D5.6 41.27,56.26 46.35,51.18 46.35,49.66 45.97,49.28 45.97,48.39 46.48,47.88 47.08,47.88 D1.70
D1SPICLK
  Top 0.3: D1.74 35.56,57.39 35.56,61.09 35.81,61.34 37.21,61.34 37.47,61.09 D5.3
D1SPICSL
  Top 0.3: D1.73 36.2,57.46 D5.2
D1SPIMISO  (via drill 0.5)
  Top 0.3: D5.7 42.55,56.13 44.89,53.79 44.91,53.79 v45.05,53.65 | D1.75 41.99,50.25 v41.65,50.25
  Bottom 0.3: v41.65,50.25 v45.05,53.65
D1SPIMOSI  (via drill 0.5)
  Top 0.3: D5.4 38.73,56.39 v42.46,52.66 | D1.76 42.03,49.5 41.35,49.5 40.75,50.1 v40.75,50.95
  Bottom 0.3: v40.75,50.95 v42.46,52.66
D2BRAKE
  Top 0.3: D15.5 18.41,58.17 18.54,58.04 19.56,58.04 22.23,55.37 25.53,55.37 26.54,54.36 26.54,50.16 34.42,42.29 34.42,42.27 D1.97
D2REVERSE  (via drill 0.5)
  Top 0.3: D15.6 19.68,58.67 22.48,55.88 26.04,55.88 27.18,54.74 27.18,50.8 v31.11,46.86 | D1.98 30.26,45.72 v29.97,45.72
  Bottom 0.3: v29.97,45.72 v31.11,46.86
D2SPICLK  (via drill 0.5)
  Top 0.3: D15.3 15.88,56.01 16.64,55.24 17.4,55.24 v18.16,54.48 | v35.18,36.45 34.16,35.43 34.16,34.96 D1.111
  Bottom 0.3: v35.18,36.45 35.18,36.96 18.16,53.98 v18.16,54.48
D2SPICSL
  Top 0.3: D1.99 30.31,44.96 29.72,44.96 29.21,45.47 29.21,46.74 25.91,50.04 25.91,53.98 25.4,54.48 20.57,54.48 20.32,54.23 20.32,53.72 19.94,53.34 17.78,53.34 17.4,53.72 17.4,54.1 17.02,54.48 15.88,54.48 14.61,55.75 D15.2
D2SPIMISO  (via drill 0.5)
  Top 0.3: D15.7 20.95,58.17 22.73,56.39 26.29,56.39 27.81,54.86 27.81,51.18 31.11,47.88 31.5,47.88 32,47.37 32,45.47 32.64,44.83 33.15,44.83 v33.27,44.7 | D1.112 35.43,35.53 35.43,35.56 35.92,36.05 v37.6,36.05
  Bottom 0.3: v33.27,44.7 32.64,44.07 32.64,43.69 37.59,38.73 v37.59,36.06 v37.6,36.05
D2SPIMOSI  (via drill 0.5)
  Top 0.3: D15.4 17.14,56.64 19.18,54.61 v19.18,54.1 | D1.113 35.03,34.42 35.81,34.42 v36.58,35.18
  Bottom 0.3: v36.58,35.18 36.58,36.32 19.05,53.85 19.05,53.98 v19.18,54.1
GND  (via drill 0.5)
  Top 0.3: A1.P43 v92.08,46.35 | A1.P32 v92.2,32.38 | A1.P30 v92.2,29.84 92.2,27.3 92.08,27.3 | A1.P28 92.08,27.3 | A1.P27 88.9,25.78 89.03,25.65 92.2,25.65 92.08,25.78 92.08,27.3 | 22.86,8.38 21.84,8.38 21.84,7.49 21.72,7.37 D12.15 17.53,7.37 | D12.4 17.53,7.37 | D12.9 17.53,6.6 | 17.53,6.6 17.53,6.73 | D12.8 17.02,6.6 | 17.02,6.6 17.02,6.73 17.53,6.73 | 13.46,5.33 14.48,5.33 14.61,5.46 14.61,6.35 14.63,6.38 D12.6 16.54,6.38 16.76,6.6 17.02,6.6 | 17.53,6.73 17.53,7.24 | 17.53,7.24 17.53,7.37 | D12.25 17.75,7.47 17.53,7.24 | D12.10 18.03,6.6 17.53,6.6 | A1.P56 84.07,38.35
  Top 0.5: A1.P16 72.77,27.3 71.75,28.32 v70.61,28.32 | A1.P38 90.7,39.88 v92.08,39.88 | A1.P1 72.77,46.35 72.9,46.48 72.9,48.26 | 72.9,48.26 v74.7,47.91 | 72.9,48.26 72.77,48.26 72.77,45.21 72.64,45.09 A1.P2 76.96,45.09 78.36,43.69 | 78.36,41.02 A1.P55 78.05,40.83 | A1.P63 84.03,35.31 | 81.03,35.31 81.03,35.43 81.05,35.41 A1.P60 | A1.P59 81.03,38.31 81.03,38.1 80.9,38.35 | A1.P61 83.95,41.23 83.95,41.27 | 84.07,38.35 83.95,38.35 | A1.P58 81.11,41.27 | C54.2 67.17,19.23 66.15,20.25 66.15,20.86 N3.2 | 85.54,39.95 90.55,39.95 | 90.6,39.95 90.55,39.95 | 90.55,39.95 90.55,40 90.6,40 | 86.78,32.35 90.6,32.35 A1.P32
  other vias: 92.08,43.81 93.22,32.38 94.23,32.38 94.87,33.15 93.22,29.84 94.23,29.84 94.87,29.08 70.61,30.23 70.61,32.51 68.71,34.67 63.88,34.67 63.88,32.51 65.41,30.38 66.29,23.44 68.61,23.44 63.5,20.32 68.71,18.92 36.26,26.91 37.97,20.7 45.74,21.12 32,27.43 38.35,30.35 41.4,27.94 38.23,35.18 45.47,27.69 48.26,25.27 46.35,32.26 43.31,34.92 49.78,35.43 48.77,30.86 51.56,33.66 55.63,38.1 53.85,39.62 48.3,38.56 47.24,37.85 47.88,45.47 39.29,41.9 61.98,36.96 68.71,36.96 70.74,40.26 68.42,43.81 62.31,50.84 58.34,44.57 60.07,42.16 19.18,23.75 19.94,20.95 25.4,21.08 25.4,22.23 21.46,20.95 10.67,23.5 8.89,23.5 8.64,33.02 10.54,33.02 13.59,49.53 11.81,49.53 24.64,52.07 17.91,52.45 19.81,47.75 28.19,46.35 30.73,49.66 29.08,51.31 33.02,41.02 26.42,44.2 29.21,38.99 36.83,45.21 39.5,46.74 39.11,52.51 44.58,50.55 37.85,58.29 45.21,59.82 30.73,59.82 14.48,54.61 23.37,59.82 20.37,56.08 9.14,59.94 10.41,54.36 13.97,39.37 14.99,39.37 16,39.37 22.35,35.43 19.81,41.27 19.43,30.1 15.75,29.97 15.75,28.96 19.43,31.11 21.46,22.1 25.27,15.37 21.46,15.37 11.18,15.75 13.46,4.06 22.23,9.65 27.43,10.54 27.3,12.57 22.73,5.59 27.43,6.6 35.69,3.3 34.67,13.72 38.73,10.54 39.88,10.54 39.88,6.73 38.73,6.73 53.09,10.54 51.94,10.54 57.4,10.54 58.55,10.54 57.4,6.73 58.55,6.73 53.09,6.73 51.94,6.73 57.53,18.29 51.94,19.68 63.25,16.76 70.74,22.73 70.74,21.72 74.3,21.72 74.3,22.73 48.64,55.75 48.64,58.55 52.7,54.61 52.7,56.01 57.28,56.01 57.28,54.61 50.67,67.56 50.67,74.8 50.67,79.63 50.8,85.72 60.07,82.42 61.72,82.42 60.95,74.8 61.85,74.8 56.39,74.93 56.39,69.98 60.45,69.98 66.67,69.85 70.61,69.85 66.67,74.8 70.74,74.8 75.56,72.39 75.82,77.47 80.14,75.95 86.11,75.95 86.11,74.93 86.11,73.91 82.3,70.61 83.31,70.61 82.93,68.45 79.32,73.41 74.55,69.98 68.71,65.28 68.71,67.69 57.28,65.28 65.12,54.63 66.37,55.73 71.37,54.48 80.26,54.61 80.26,59.44 78.36,63.25 75.49,60.3 82.93,61.85 83.95,61.85 84.96,61.85 85.85,61.21 86.87,61.21 87.88,61.21 91.44,67.06 92.33,67.06 93.22,67.06 91.95,62.36 91.95,61.47 92.2,60.58 96.01,60.96 84.71,65.28 84.71,64.26 84.71,63.25 84.2,58.42 84.2,57.4 97.41,70.99 97.41,70.1 97.41,69.09 99.06,65.53 99.06,64.52 99.06,50.8 98.04,50.8 88.52,50.93 88.52,48.77 50.16,48.01 46.61,53.59 48.39,52.45 40.01,51.69 37.85,53.72 35.05,56.07 32.3,56.07 31.05,58.27 29.1,53.77 81.82,48.37 64.37,44.02 63.52,50.82 62.32,54.63 76.07,47.92 77.47,47.92 39.52,24.8 88.97,25.43 29.22,34.33 26.27,34.33 25.47,30.83 22.72,30.78 25.52,26.98 22.17,27.03 7.87,28.38 7.82,36.93 18.37,36.48 8.02,43.03 18.72,45.68 22.42,46.53 3.27,63.28 83.32,95.78 85.07,97.48 86.87,95.73 85.07,93.98 60.97,89.58 60.97,87.68 98.97,27.98 99.07,34.18 69.37,83.87 72.22,78.07 84.67,85.32 85.27,84.52 85.57,83.47 85.62,82.27 86.16,69.16 60.95,78.25 60.95,77.35 60.9,81.7 70.37,84.82 70.37,85.77 70.37,86.72 66.67,75.72 72.12,55.32 72.87,56.17 80.27,55.72 61.02,50.82 48.67,59.67 52.72,57.02 42.27,45.02 44.82,47.52 58.27,31.07 54.82,27.42 57.97,29.27 52.59,23.84 53.29,14.29 57.09,13.29 14.54,6.08 14.54,7.63 30.13,5.05
  pour Top (rank 2): 0,100 99.75,100 99.75,0 0,0
  pour Bottom (rank 2): 0,100 100,100 100,0 0,0
I2C1SCL
  Top 0.3: D1.136 41.57,24.68 40.89,24 38.1,24 33.4,19.3 33.4,13.63 R29.1 33.36,12.74 34.42,11.68 D11.2 | D11.2 34.42,9.78 | D11.2 34.42,8.51 34.05,8.15 34.04,8.13 34.01,8.1 31.25,8.1 27.72,4.57 18.8,4.57 18.54,4.83 D12.11
I2C1SDA  (via drill 0.5)
  Top 0.3: D1.137 40.83,23.24 39.24,23.24 35.94,19.94 35.94,13.55 | 35.94,13.46 35.94,13.55 | 35.94,13.55 R28.1 35.98,12.23 35.69,11.94 v35.69,11.56 D11.1 | D12.16 20.83,7.87 21.08,8.13 21.08,10.67 21.97,11.56 v32.89,11.56
  Bottom 0.3: v32.89,11.56 v35.69,11.56
MEAS12V
  Top 0.3: D1.34 59.35,32.89 59.75,32.89 59.75,32.9 67.3,40.45 67.3,52.19 72.64,57.53 C47.1
  Top 0.5: R35.2 77,61.15 R36.2 76.96,58.89 C47.1 76.96,57.4
MOTOR_CURR  (via drill 0.5)
  Top 0.3: N2.1 80.11,67.64 80,67.75 80,68 79.75,68.25 77.75,68.25 77.44,67.94 R41.1 77.05,66.25 76.45,65.66 75.69,65.66 73.53,63.5 73.53,59.44 73.15,59.05 71.88,59.05 65.65,52.82 65.65,47.05 64.7,46.1 62.1,46.1 v60.07,44.07 | D1.13 49.58,27.81 49.02,27.81 46.61,30.23 46.61,30.61 v46.86,30.86
  Bottom 0.3: v46.86,30.86 v60.07,44.07
MOTOR_H1  (via drill 0.5)
  Top 0.3: V18.1 72.71,73.54 72.94,73.31 R7.1 72.94,68.87 70.87,66.8 56.01,66.8 55.75,66.55 55.75,48.27 55.37,47.89 v55.37,44.83 | D1.4 42.29,28.74 v42.29,31.75
  Bottom 0.3: v42.29,31.75 42.67,32.13 43.81,32.13 55.37,43.69 v55.37,44.83
MOTOR_H2  (via drill 0.5)
  Top 0.3: V20.1 76.52,73.98 76.75,73.75 R34.1 76.75,71.67 76.2,71.12 73.79,71.12 73.41,70.74 73.41,68.58 71.12,66.29 56.52,66.29 56.26,66.04 v56.26,45.66 | D1.5 43.31,28.43 v43.31,30.86
  Bottom 0.3: v43.31,30.86 56.26,43.81 v56.26,45.66
MOTOR_L1  (via drill 0.5)
  Top 0.3: V22.4 83.44,81.56 83.7,81.3 R37.1 | R37.1 83.72,80.47 83.75,80.5 | R37.1 84.51,80.47 84.71,80.26 84.71,68.07 81.79,65.15 75.95,65.15 74.04,63.25 74.04,59.05 73.53,58.55 72.14,58.55 66.2,52.61 66.2,42.75 65.49,42.04 v62.48,42.04 | D1.2 46.24,23.37 45.47,23.37 44.83,24 44.83,24.51 v45.09,24.77
  Bottom 0.3: v45.09,24.77 45.34,25.02 45.97,25.02 61.59,40.64 61.59,41.15 v62.48,42.04
MOTOR_L2  (via drill 0.5)
  Top 0.3: R38.1 80.99,81.24 81,81.25 80.89,81.36 V22.2 80.89,83.89 81.25,84.25 84.25,84.25 84.5,84 84.5,81.5 84.75,81.25 84.75,81.24 85.22,80.77 85.22,67.82 82.04,64.64 76.2,64.64 74.55,62.99 74.55,58.8 73.79,58.04 72.39,58.04 66.75,52.4 66.75,42.1 66.05,41.4 63.12,41.4 v62.48,40.77 | D1.3 46.19,24.13 v45.85,24.13
  Bottom 0.3: v45.85,24.13 v62.48,40.77 62.48,40.89
N$1
  Top 0.3: 93.25,59.25 93.25,59 94,58.25 L1.1
  Top 0.5: C4.1 93.23,59.27 93.25,59.25 92,59.25 | 89.52,62.83 89.59,62.75 | V13.C 88.47,55.97 90.5,58 90.5,59.5 90.75,59.75
  Top 0.55: N1.8 89.59,62.75 89.59,62.66 89.75,62.5
  Top 1: 89.75,62.5 89.75,60.25 90,60 90,62.25 90.25,62.5 90.5,62.5 90.75,62.25 90.75,60.5 | 90.75,59.75 90.75,60.5 | 90.75,60.5 92,59.25
N$2
  Top 0.5: C4.2 94.73,62.56 N1.1
N$3
  Top 0.3: V19.2 74.05,81.95 74.5,81.5 74.5,79.25 | 74.5,79.25 74.5,77.5 74.25,77.25 73.71,77.25 V18.3 | R6.1 74.47,79.28 74.5,79.25
N$4
  Top 0.3: R1.2 R2.1 | R2.1 97.79,64.21 97.75,64.25 97.75,64.11 R2.1 | R2.1 96.69,64.06 96.5,64.25 96.5,66.25 96.11,66.64 N1.4
N$5
  Top 0.3: N12.3 16.36,48.9 14.99,50.26 14.99,53.34 R56.2 R54.1
N$6
  Top 0.3: V19.4 77.52,82.73 78.5,81.75 78.5,79.25 | 78.5,79.25 78.5,77.5 78.25,77.25 77.42,77.25 | 77.25,77.25 77.42,77.25 | 77.42,77.25 V20.3 | R33.1 78.48,79.27 78.5,79.25
N$7
  Top 0.3: 82.25,81.5 82.25,82.64 V22.3 | 79.5,81.75 79.5,82.6 V22.1 | R38.2 80.99,77.26 81,77.25 | R37.2 83.7,77.95 83.5,77.75 82.5,77.75 82,77.25 | R39.2 83.92,75.08 84.25,74.75 84.25,70 83.75,69.5 81.31,69.5 N2.3
  Top 1: 82.25,81.5 82.55,81.2 R39.2 82.55,76.7 82,77.25 81,77.25 80.25,77.25 79.5,78 79.5,81.75
N$8
  Top 2: F1.3 F1.2 87.53,85 87.5,85 87.58,85.08 90.17,85.08 | X6.2 90.17,85.08 | 90.17,85.08 90.25,85
N$9
  Top 0.3: R41.2 77.17,69.52 N2.4 78.69,70.16 R40.1
N$10
  Top 0.3: V2.2 65.41,76.41 64.77,75.77 | V5.3 64.77,75.75 | 64.77,75.75 64.77,75.77 | R8.1 62.23,76.27 62.75,75.75 64.75,75.75 | 64.77,75.77 64.75,75.75 | 64.77,75.75 64.75,75.75
N$11
  Top 0.3: V3.3 68.58,75.67 68.5,75.75 | 68.5,75.75 67.94,76.31 V2.4 | R12.1 69,76.75 68.5,76.25 68.5,75.75
N$12
  Top 0.3: R55.1 R57.2 15.79,46.53 16,46.75 20,46.75 20.88,47.62 N12.5
N$13
  Top 0.3: V4.4 57.78,76.22 58.25,75.75 | V7.3 58.36,75.64 58.25,75.75 | R9.1 58.74,76.75 58.25,76.25 58.25,75.75
N$14
  Top 0.3: N12.2 19.84,50.16 20.25,49.75 20.25,49.25 20.61,48.9 N12.6 24.11,48.9 24.5,48.5 24.5,47 23.36,45.87 R45.2 R46.1
N$15
  Top 0.3: V9.3 54.42,75.67 | V4.2 55.24,76.5 54.42,75.67 | R10.1 52.07,75.93 52.25,75.75 54.34,75.75 54.42,75.67
N$16
  Top 0.3: D1.109 30.86,33.08 30.86,24.13 32.13,22.86 R47.2
N$17
  Top 0.5: V24.6 53.8,87.7 53.34,88.16 V12.C
  Top 1: X3.7 54.61,93.36 53.34,92.09 V12.C
N$18
  Top 0.5: C6.1 29.98,77.52 30,77.5 R5.1
N$19
  Top 0.5: V24.4 57.23,89.6 V11.C
  Top 1: V11.C 57.15,91.9 59.69,94.44 X3.5
N$20
  Top 0.5: V24.3 64.69,89.6 V10.C
  Top 1: V10.C X3.3
N$21
  Top 0.5: V24.1 67.95,87.7 68.58,88.33 V8.C
  Top 1: V8.C 68.58,92.08 69.85,93.35 X3.1
N$22
  Top 0.3: D1.105 33.78,37.24 33.78,36.96 32.51,35.69 32,35.69 29.84,33.53 29.84,22.73 29.59,22.48 R42.2
N$23
  Top 0.3: H2.C R24.2
N$24
  Top 0.5: R17.1 C12.1
N$25
  Top 0.3: H1.C 44.2,10.3 44.15,10.25 44.17,10.25 R18.2
N$26  (via drill 0.5)
  Top 0.3: D1.139 41.55,22.55 41.55,20.35 44.2,17.7 v44.2,17.35 | v44.2,14.2 H1.A 44.2,13.15
  Bottom 0.3: v44.2,17.35 v44.2,14.2
N$27  (via drill 0.5)
  Top 0.3: D1.140 42.05,22.34 42.05,20.6 44.55,18.1 46.05,18.1 46.8,17.35 v46.8,17.2 | v46.8,14.2 H2.A
  Bottom 0.3: v46.8,17.2 v46.8,14.2
N$28
  Top 0.3: H3.C R25.2
N$29
  Top 0.3: D1.48 56.41,41.66 57.4,41.66 57.78,42.03 R20.2
N$30
  Top 0.3: C25.1 A1.P31 90.55,31.11
N$31
  Top 0.3: C25.2 95.85,31.11 X7.SIG
N$32
  Top 0.3: A1.P21 81.28,25.02 81.41,24.89 81.32,24.89 R21.2
N$33
  Top 0.2: 81.58,2.21 arc7 81.79,2.33 82.51,1.78 82.92,2.19 82.36,2.91 arc23 82.69,3.69 83.59,3.81 83.59,4.39 82.69,4.51 arc23 82.36,5.29 82.92,6.01 82.51,6.42 81.79,5.87 arc23 81.01,6.19 80.89,7.09 80.31,7.09 80.19,6.19 arc23 79.41,5.87 78.69,6.42 78.28,6.01 78.83,5.29 arc23 78.51,4.51 77.61,4.39 77.61,3.81 78.51,3.69 arc23 78.83,2.91 78.28,2.19 78.69,1.78 79.41,2.33 arc7 79.62,2.21 80.15,3.24 arc-62 79.63,4.1 arc-242 81.05,3.24 81.58,2.21
N$34
  Top 0.3: R22.2 A1.P10 | 74.55,34.92 A1.P10 | A1.P10
N$35
  Top 0.3: A1.P23 R23.2
N$42
  Top 0.5: R32.1 8.16,79.98 C39.1
NERT
  Top 0.5: V2.6 67.25,82.37 V2.5
  Top 1: V8.A 68.58,85.33 67.25,84 67.25,82.37
NERT1
  Top 0.5: V2.8 64.75,82.37 V2.7
  Top 1: V10.A 64.77,82.39 64.75,82.37
NERT2
  Top 0.5: V4.5 57.25,82.37 V4.6
  Top 1: V11.A 57.15,82.47 57.25,82.37
NERT3
  Top 0.5: V4.7 54.5,82.37 V4.8
  Top 1: V12.A 53.34,85.16 54.5,84 54.5,82.37
NERT4
  Top 0.5: V19.8 73.5,87.45 V19.7 | V22.5 82.75,87.45 V22.6
  Top 0.8: C7.1 78,84.5
  Top 1: X1.1 74.93,90.68 V21.A 74.42,90.17 73.5,89.25 73.5,87.45 73.5,85.25 74.25,84.5 78,84.5 78.75,84.5 79.5,85.25 82.25,85.25 82.75,85.75 82.75,87.45
NERT5
  Top 0.5: V19.6 V19.5 | V22.8 80.5,87.45 V22.7
  Top 0.8: C7.2 78,87.5
  Top 1: V19.5 75.8,87.45 75.75,87.5 78,87.5 80.25,87.5 | 80.25,87.5 80.45,87.5 80.5,87.45 | V21.C 79.54,90 | 79.54,90 79.54,89.71 80.25,89 80.25,87.5 | X1.2 80.01,90.51 79.5,90 79.54,90
OSCIN
  Top 0.3: D1.23 55.75,28.7 55.75,27.94 57.53,26.16 | G1.1 58.22,24.2 57.4,25.02 57.4,25.53 57.53,25.65 57.53,26.16 | 57.53,26.16 57.53,26.17 57.2,26.5 57.2,26.52 C23.1
OSCOUT
  Top 0.3: G1.3 61.65,24.06 62.36,24.77 62.36,25.27 60.07,27.56 59.56,27.56 59.05,27.05 58.63,27.05 C24.1 58.07,27.66 56.77,28.96 56.21,28.96 D1.24
OUT1  (via drill 0.5)
  Top 0.3: V3.1 67.63,71.12 67.86,70.89 R11.1 67.86,67.86 67.31,67.31 55.5,67.31 55.24,67.06 55.24,49.14 v54.93,48.83 | D1.18 44.48,36.45 v44.07,36.45
  Bottom 0.3: v44.07,36.45 45.59,37.97 45.59,39.5 53.72,47.62 53.73,47.62 54.1,48 54.36,48.25 v54.93,48.83
OUT2  (via drill 0.5)
  Top 0.3: V5.1 63.82,71.18 64.05,70.95 R13.1 64.05,68.11 63.75,67.82 55.12,67.82 54.74,67.44 54.74,49.78 v53.85,48.9 | D1.19 44.17,37.47 v43.81,37.47
  Bottom 0.3: v43.81,37.47 44.96,38.61 44.96,39.62 53.85,48.51 v53.85,48.9
OUT3  (via drill 0.5)
  Top 0.3: V7.1 57.41,71.34 57.63,71.11 R14.1 57.63,69.19 57.15,68.71 54.74,68.71 54.23,68.2 54.23,50.29 v52.83,48.9 | D1.20 43.86,38.48 v43.56,38.48
  Bottom 0.3: v43.56,38.48 44.32,39.24 44.32,39.75 52.83,48.26 v52.83,48.9
OUT4  (via drill 0.5)
  Top 0.3: V9.1 53.5,72.53 53.5,71.25 53.7,71.06 R15.1 53.7,50.77 v51.82,48.9 | D1.21 v43.43,39.61 v43.43,39.62
  Bottom 0.3: v43.43,39.62 51.82,48.01 v51.82,48.9
POT1  (via drill 0.5)
  Top 0.3: R50.1 15.53,24.92 C51.1 16.28,24.53 16.75,25 19.54,25 19.81,25.27 19.81,28.32 20.83,29.34 v22.86,29.34 | D1.14 49.65,28.45 49.15,28.45 47.75,29.84 v47.75,30.1
  Bottom 0.3: v47.75,30.1 47.5,29.72 39.5,29.72 38.61,28.83 24.13,28.83 23.62,29.34 v22.86,29.34
POT2  (via drill 0.5)
  Top 0.3: R51.1 15.63,22.38 C50.1 16.25,22.25 16.5,22 19,22 20.32,23.32 20.32,27.69 20.95,28.32 v22.86,28.32 | D1.15 49.21,29.59 v49.15,29.59
  Bottom 0.3: v22.86,28.32 38.86,28.32 39.75,29.21 47.37,29.21 47.5,29.08 48.39,29.08 48.9,29.59 v49.15,29.59
POT_IN_1
  Top 0.3: R50.2 12.33,24.92 12,25.25 12,25.75 11.75,26 9,26 8.8,25.8 V28.3
  Top 0.5: X10.4 5.58,26.67 7.5,24.75 V28.3
POT_IN_2  (via drill 0.5)
  Top 0.3: V28.6 13.12,22.25 R51.2
  Top 0.5: v10.75,20.25 10.75,22.25 V28.6
  Bottom 0.5: X10.7 9.55,19.05 v10.75,20.25
RESETL  (via drill 0.5)
  Top 0.3: D1.25 56.16,29.72 57.15,29.72 57.66,30.23 59.44,30.23 63.88,25.78 | 63.88,25.78 63.88,22.86 58.29,17.27 58.29,14.99 58.04,14.73 55.5,14.73 55.12,15.11 55.12,15.98 D10.1 54.44,16.05 53.98,16.51 53.12,16.51 R16.1 53.09,16.51 51.82,16.51 51.18,15.88 37.59,15.88 37.21,16.26 X5.5 | 63.88,25.78 64.01,25.91 v64.01,26.8 | v70.74,26.8 70.74,26.29 70.99,25.91 v80.01,25.91 | v92.46,36.2 A1.P35 90.55,36.2
  Bottom 0.3: v64.01,26.8 v70.74,26.8 | v80.01,25.91 88.14,25.91 88.39,26.16 88.39,35.56 89.03,36.2 v92.46,36.2
REVERSE_1  (via drill 0.5)
  Top 0.3: V1.2 31.11,82.64 v31.5,82.25 | v42.5,70 42.5,67.5 41.27,66.28 D5.11
  Bottom 0.3: v31.5,82.25 36.25,82.25 40.25,78.25 40.25,71.75 41.5,70.5 42,70.5 v42.5,70
REVERSE_2  (via drill 0.5)
  Top 0.3: V6.2 9.53,82.72 v10,82.25 | v21,70.25 21,67.5 19.68,66.19 D15.11
  Bottom 0.3: v10,82.25 14.75,82.25 18.5,78.5 18.5,72 20.25,70.25 v21,70.25
REVERSE_OD_1  (via drill 0.5)
  Top 0.5: V1.7 30.5,88.72 V1.8 | V14.3 40.51,90.49 v40.25,90.75
  Top 1: X2.7 33.02,95.02 30.5,92.5 30.5,88.72
  Bottom 0.5: v40.25,90.75 36.5,90.75 33,94.25 33,96.5 33.02,96.5 X2.7
REVERSE_OD_2  (via drill 0.5)
  Top 0.5: V6.8 9,88.72 V6.7 | V25.3 19.01,90.49 v18.75,90.75
  Top 1: X8.7 11.43,94.68 9,92.25 9,88.72
  Bottom 0.5: v18.75,90.75 15,90.75 11.25,94.5 11.25,96.34 X8.7
SPEED1  (via drill 0.5)
  Top 0.3: N12.1 20.7,51.44 21.34,50.8 24.64,50.8 25.02,50.42 25.02,49.66 v26.54,48.13 | v32.89,48.13 37.03,48.13 38.2,49.3 39.45,49.3 40.5,48.25 40.5,47.5 D1.81
  Bottom 0.3: v26.54,48.13 v32.89,48.13
SPEED2  (via drill 0.5)
  Top 0.3: N12.7 24.38,50.16 24.51,50.04 24.51,49.4 25.65,48.26 25.65,47.88 26.16,47.37 v27.3,47.37 | v33.78,47.37 36.96,47.37 38.39,48.8 39.15,48.8 40.03,47.92 40.03,47.26 D1.82
  Bottom 0.3: v27.3,47.37 30.1,47.37 30.35,47.62 31.88,47.62 32.38,47.12 33.53,47.12 v33.78,47.37
SPEED_SENSOR_1
  Top 0.3: R43.1 11.93,53.38 R54.2 11.75,53.12 V27.3
  Top 0.5: X11.2 8.85,53.34 R43.1
SPEED_SENSOR_2
  Top 0.3: R44.1 11.93,45.77 R55.2 11.75,45.95 V27.4
  Top 0.5: R44.1 3.85,45.77 X11.5
SPICLK_1  (via drill 0.5)
  Top 0.3: D5.14 37.47,66.47 38.75,67.75
  Top 0.5: N4.3 38.73,68.27 v38.75,68.25 38.75,67.75 | v46.25,68.5 46.25,68.75 46.35,68.86 N6.7
  Bottom 0.3: v38.75,68.25 46,68.25 v46.25,68.5
SPICLK_2  (via drill 0.5)
  Top 0.3: N8.3 17.14,68.11 | D15.14 15.88,66.38 17.25,67.75 | 24.75,70 24.75,70.01 N10.7
  Top 0.5: 17.14,68.11 v17.25,68 17.25,67.75 | v24.75,68.5 24.75,70
  Bottom 0.3: v17.25,68 24.25,68 v24.75,68.5
SPICSL_1
  Top 0.3: D5.15 36.2,66.69 37.47,67.97 N4.2 37.47,71.22 37.75,71.5 43.5,71.5 43.81,71.19 N6.5
SPICSL_2
  Top 0.3: D15.15 14.61,66.61 15.88,67.88 N8.2 15.88,71.38 16,71.5 22,71.5 22.23,71.28 N10.5
SPIMISO_1
  Top 0.3: D5.10 42.55,66.3 43.25,67 44.5,67 45.09,67.58 N6.6
SPIMISO_2
  Top 0.3: D15.10 20.95,66.2 21.75,67 23,67 23.5,67.5 N10.6
SPIMOSI_1
  Top 0.3: D5.13 38.73,66.23 40.01,67.5 N4.4
SPIMOSI_2
  Top 0.3: D15.13 17.14,66.14 18.41,67.42 N8.4
SWCLK
  Top 0.3: X5.3 R47.1
SWDIO
  Top 0.3: X5.2 R42.1
THROTTLE_1
  Top 0.3: R49.2 38.52,77.27 38.25,77 36.75,77 36.2,76.44 N4.8
  Top 0.5: N5.3 38.73,82.2 R49.2
THROTTLE_2
  Top 0.3: N9.3 17.14,82.2 | R48.2 17.02,77.27 16.75,77 15.25,77 14.61,76.36 N8.8
  Top 0.5: 17.14,82.2 R48.2
THROTTLE_BUFFERED_1
  Top 0.3: 38.73,86.73 38.73,86.98 38.75,87
  Top 0.5: N5.2 37.47,85.47 38.73,86.73 N5.6 38.73,95.89 X2.5 | V14.4 44.43,90.18 44,89.75 41.5,89.75 41,89.25 41,87.25 40.75,87 38.75,87
THROTTLE_BUFFERED_2
  Top 0.5: X8.5 17.14,95.89 N9.6 17.14,87.39 17,87.25 | 17,87.25 15.88,86.12 N9.2 | V25.4 22.84,90.09 22.5,89.75 19.75,89.75 19.25,89.25 19.25,87.5 18.75,87 17.25,87 17,87.25
USART1CTS  (via drill 0.5)
  Top 0.3: D1.103 34.74,37.7 39.75,37.7 42.95,40.9 v50.1,40.9 | v70.1,50.3 71.3,50.3 71.65,50.65 84.4,50.65 87.15,47.9 88.4,47.9 88.9,47.4 88.9,46.4 88.95,46.35 A1.P44
  Bottom 0.3: v50.1,40.9 50.95,40.9 53.8,43.75 53.8,45.05 55.65,46.9 69.45,46.9 69.7,47.15 69.7,47.95 69.75,47.95 70.45,48.65 70.45,49.95 v70.1,50.3
USART1RTS  (via drill 0.5)
  Top 0.3: D1.104 34.53,37.2 39.95,37.2 43.15,40.4 49.45,40.4 v50,39.85 | v70.5,46.4 71.7,46.4 72,46.7 72,48.75 72.3,49 78.75,49 79.95,47.8 79.95,46.35 80,46.3 | 80,46.3 80.05,46.25 80.05,46.35 | 80.05,46.35 80,46.3 | 80,46.3 80,46.4 80.05,46.35 | A1.P51 80.05,46.35 | 80.05,46.35
  Bottom 0.3: v50,39.85 50.65,39.85 54.35,43.55 54.35,44.85 55.9,46.4 v70.5,46.4
USART1RX  (via drill 0.5)
  Top 0.3: D1.102 34.95,38.2 39.55,38.2 42.75,41.4 48.65,41.4 49.25,42 v50.15,42 | v69.7,49.15 71,49.15 71.85,50 84.1,50 86.3,47.8 86.3,46.4 A1.P46 86.35,46.3 86.36,46.31 A1.P46
  Bottom 0.3: v50.15,42 51.25,42 53.2,43.95 53.2,45.2 55.4,47.4 68.85,47.4 69.2,47.75 69.2,48.65 v69.7,49.15
USART1TX  (via drill 0.5)
  Top 0.3: D1.101 35.16,38.7 39.35,38.7 42.55,41.9 48.45,41.9 49.65,43.1 v50.45,43.1 | v70.5,47.4 71.4,47.4 71.5,47.5 71.5,48.95 72.1,49.5 83.45,49.5 85.1,47.85 85.1,46.37 A1.P47
  Bottom 0.3: v50.45,43.1 50.45,43.25 55.2,48 68.45,48 68.7,48.25 68.7,50.7 69,51.1 70.75,51.1 71.05,50.8 71.05,47.95 v70.5,47.4
USART3RX
  Top 0.3: D1.78 41.62,48.5 41.05,48.5 39,50.55 34.8,50.55 33.95,51.4 33.95,51.8 33.94,51.81 X9.2
USART3TX
  Top 0.3: D1.77 41.83,49 41.2,49 38.35,51.85 36.5,51.85 36.5,51.8 36.48,51.82 X9.3
V+1  (via drill 0.5)
  Top 0.3: 35.1,67.25 35.25,67.25
  Top 0.5: C33.1 37.47,91.33 N5.7 37.47,87.22 v37,86.75 | C36.1 35.1,67.25 35.1,68.1 35.25,68.25 35.75,68.25 36.2,68.69 N4.1 36.2,72.19 36.25,72.25 | D5.16 34.92,66.92 35.25,67.25 | 32.5,72.25 30.25,72.25 29.84,71.84 N7.1 29.84,67.44 C34.1 | 32.5,72.25 36.25,72.25 | 36.25,72.25 42.5,72.25 | 42.5,72.25 47,72.25 47.62,71.62 N6.8 47.62,67.42 C35.1 | N7.3 32.38,72.14 32.5,72.25 | 42.5,72.5 42.5,72.25
  Top 1: v43.25,86 43.18,85.93 V15.C 43.18,79.18 42.5,78.5 | 42.5,78.5 42.5,78.67 C37.+ | 42.5,78.5 42.5,72.5
  Bottom 0.5: v37,86.75 42.5,86.75 v43.25,86
  Bottom 1: v43.25,86 43.25,93.75 42.75,94.25 41,94.25 40.75,94.5 40.75,96.41 X2.4
V+2  (via drill 0.5)
  Top 0.5: C43.1 26.04,67.42 N10.8 26.04,71.72 25.5,72.25 21,72.25 | 21,72.25 14.75,72.25 | 14.75,72.25 10.75,72.25 | 10.75,72.25 8.75,72.25 8.26,71.75 N11.1 8.26,67.42 C41.1 | N11.3 10.79,72.2 10.75,72.25 | 14.75,72.25 14.61,72.11 N8.1 14.61,68.61 14.25,68.25 13.75,68.25 13.5,68 13.5,67.36 C42.1 13.34,67.19 D15.16 | 21,72.5 21,72.25 | v15.25,87 15.88,87.62 N9.7 15.88,91.33 C44.1
  Top 1: 21,78.5 21.5,79 v21.5,86 21.5,84.4 V17.C | 21,78.5 21,78.72 C45.+ | 21,78.5 21,72.5
  Bottom 0.5: v15.25,87 20.5,87 v21.5,86
  Bottom 1: v21.5,86 21.5,94 21,94.5 19.25,94.5 19,94.75 19,96.5 19.03,96.5 X8.4
V-1  (via drill 0.5)
  other vias: 45.25,83.5 41.25,83.5 48.5,83.5 35,83.5 34,78.75 34,79.75 34,77.75 35,70 32.45,68.25 45,64.75 48.5,63 29.25,63 45,76.75 41.25,75 32.25,86.25 31.25,86.25 45,94.25 37.25,94.25 34.75,90.5 35,74.75 42,88.25 44.5,88.25
  pour Bottom: 29,99.75 48.75,99.75 48.75,62.75 29,62.75
  pour Top: 29,99.75 48.75,99.75 48.75,62.75 29,62.75
V-2  (via drill 0.5)
  other vias: 23.5,94 15.75,94 13.25,90.5 9.5,86.25 10.75,86.25 13.25,83.5 19.75,83.5 23.75,83.5 27,83.5 27,63 7.5,63 10.8,68.3 13.5,70 12.5,79.75 12.5,78.75 12.5,77.75 19.5,74.75 23.5,64.75 23.5,76.75 13.25,74.75 20.25,88.25 23,88.25
  pour Bottom: 7.25,99.75 27.25,99.75 27.25,62.75 7.25,62.75
  pour Top: 7.25,99.75 27.25,99.75 27.25,62.75 7.25,62.75
VCAP1
  Top 0.3: D1.71 48.87,50.38 C9.1
VCAP2
  Top 0.3: D1.106 31.14,39.18 C8.1
VDDA
  Top 0.3: D1.33 58.39,33.17 59.18,32.38 59.36,32.38 C10.1
  Top 0.5: C10.1 60.82,31 61.85,29.97 61.85,30.1 C11.1 61.83,30.06 L2.1
VDDAREF
  Top 0.5: L3.1 64.9,18.92 | 64.9,18.92 N3.1 64.9,22.2 65.2,22.5 67.25,22.5 67.44,22.31 N3.3 | 64.9,18.92 C54.1 | C55.1 64.9,18.92
VREF25  (via drill 0.5)
  Top 0.3: N13.3 14.59,16.91 15.5,16 15.5,14.75 16,14.25 30.38,14.25 31.5,15.37 v32,15.37 | R17.2 63.88,28.19 63.37,27.69 62.74,27.69 59.18,31.24 59.18,31.62 58.55,32.26 58.55,32.28 D1.32 | v36.83,15.37 53.59,15.37 54.74,14.22 58.29,14.22 58.8,14.73 58.8,17.02 64.9,23.11 64.9,25.4 65.02,25.53 64.97,25.53 N3.8
  Top 0.5: N3.7 N3.8 64.9,28.19 R17.2
  Bottom 0.3: v32,15.37 v36.83,15.37
VREF25_1  (via drill 0.5)
  Top 0.5: N7.8 29.84,73.41 30.25,73 31.25,73 | 31.25,73 38.75,73 | 38.75,73 41.12,73 v41.25,73.12 | v43.62,73.12 43.75,73 47.25,73 47.62,73.38 N6.1 | N4.6 38.73,73.02 38.75,73 | 31.25,73 31.11,73.14 N7.7 31.11,76.11 31.5,76.5 31.5,77.42 R5.2
  Bottom 0.5: v41.25,73.12 v43.62,73.12
VREF25_2  (via drill 0.5)
  Top 0.5: N11.8 8.26,73.5 8.75,73 9.5,73 | 9.5,73 17.25,73 | 17.25,73 19.38,73 v19.5,73.12 | v22.25,73.12 22.38,73 25.75,73 26,73.25 26,74.75 N10.1 | 9.5,73 9.53,73.03 N11.7 9.53,77.38 R32.2 | N8.6 17.14,73.11 17.25,73
  Bottom 0.5: v19.5,73.12 v22.25,73.12
VREF25BUF
  Top 0.5: X10.3 2.21,29.21 1.75,28.75 1.75,22.25 2.41,21.59 X10.6 6.59,21.59 7.25,22.25 V28.4 8.8,18.7 9.31,18.18 N13.2 14.81,18.18 16.09,16.91 N13.6 22.91,16.91 23.75,17.75 23.75,42.5 23.25,43 21,43 20.77,43.23 R46.2

## Text on the board
tPlace: TELAKONE OHJAIN / V1.00 / KIMMOLI 2016 | RUN | ERR | PWR | https://github.com/kimmoli/telakone-controller